# EAGLE design PololuPCB_trial3 (EAGLE 8.3.2)
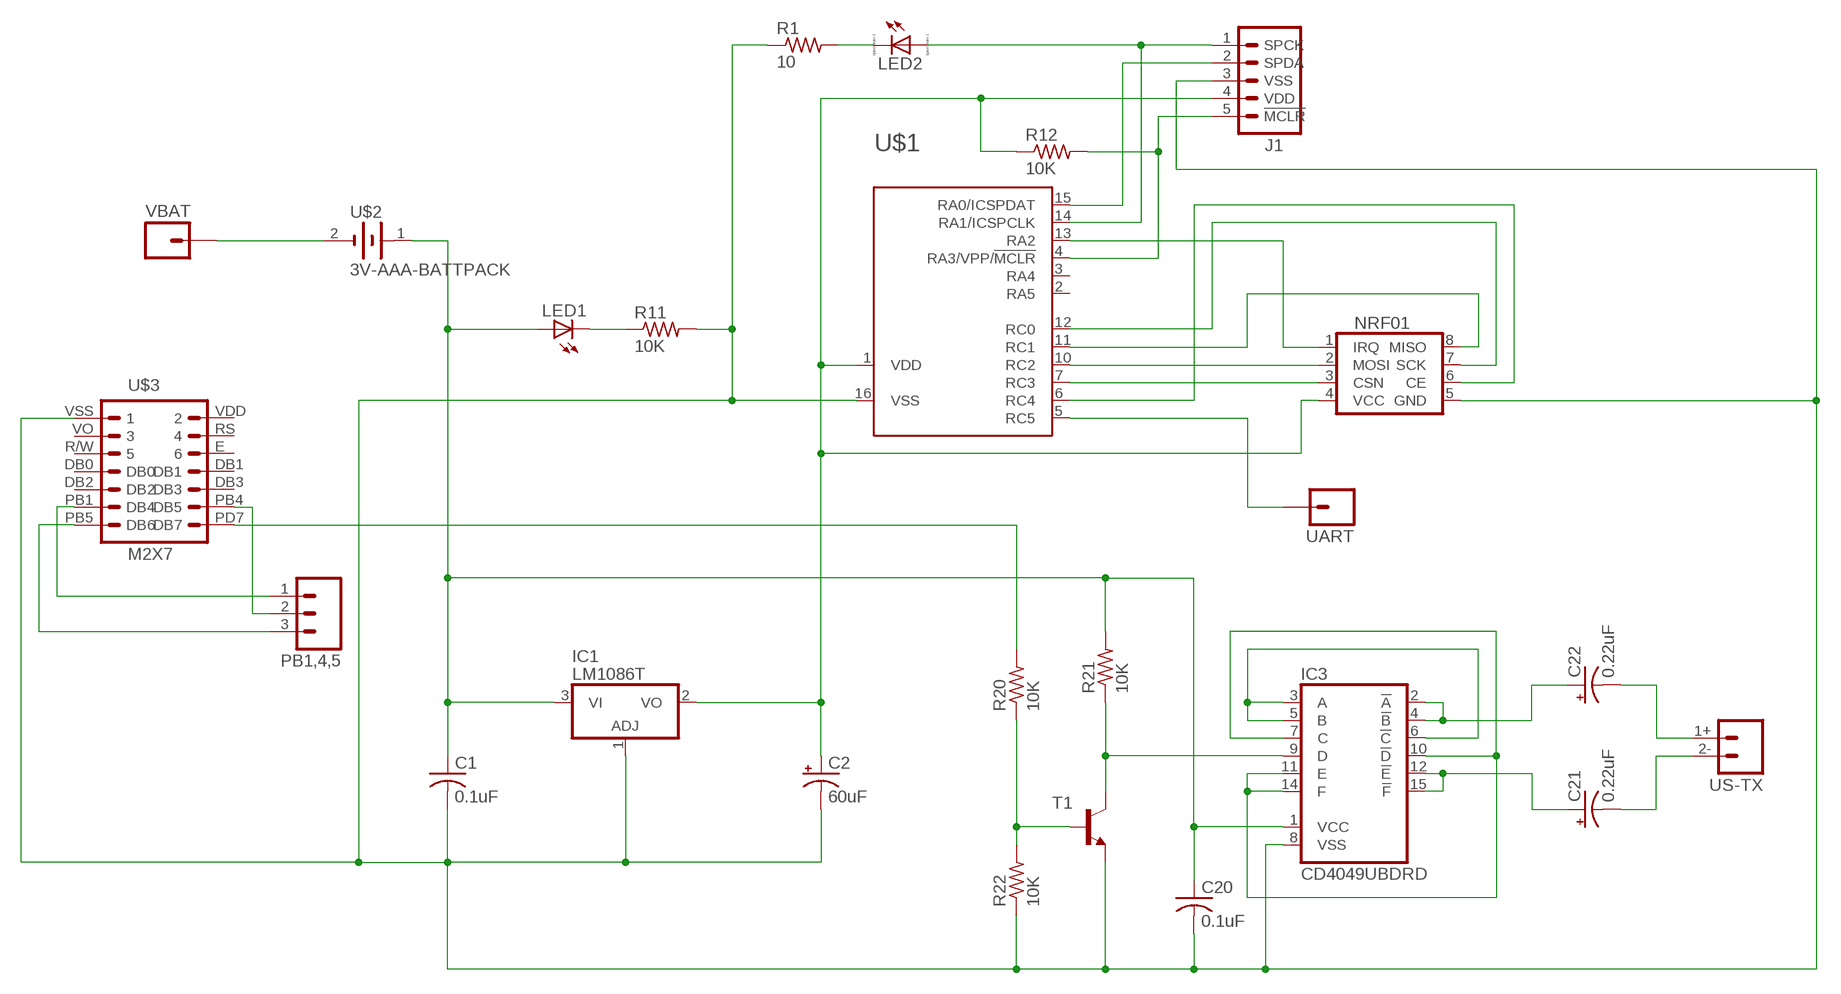
[diagram p0: schematic, sheet 1]

## Parts
C1  0.1uF  C-USC0805  [C0805]
C2  60uF  CPOL-USE2.5-5  [E2,5-5]
C20  0.1uF  C-USC0805  [C0805]
C21  0.22uF  CPOL-USE2,5-6E  [E2,5-6E]
C22  0.22uF  CPOL-USE2,5-6E  [E2,5-6E]
IC1  LM1086T  [TO220H]
IC3  CD4049UBDRD  [SO16]
J1  M05PTH  [1X05]
LED1  LED5MM  [LED5MM]
LED2  LED_E  [LED_1206]
NRF01  NRF01  [JP4Q]
PB1,4,5  M03PTH  [1X03]
R1  10  R-US_R0805  [R0805]
R11  10K  R-US_R0805  [R0805]
R12  10K  R-US_R0805  [R0805]
R20  10K  R-US_R0805  [R0805]
R21  10K  R-US_R0805  [R0805]
R22  10K  R-US_R0805  [R0805]
T1  -NPN-SOT23-EBC  [SOT23-EBC]
U$1  PIC16F1503(DIL16)  [DIL16]
U$2  3V-AAA-BATTPACK  [3V-AAA-BATTPACK]
U$3  M2X7  [2X07]
UART  M01PTH_LONGPAD  [1X01_LONGPAD]
US-TX  M02UT-1640K-TT-2-R  [ULTRASONIC-PEIZO]
VBAT  M01PTH_LONGPAD  [1X01_LONGPAD]

## Nets
N$1: IC3.9(D) R21.1 T1.C
N$2: R20.2 U$3.PD7(DB7)
N$3: IC3.7(C) IC3.10(!D) IC3.11(E) IC3.14(F)
N$4: IC3.3(A) IC3.5(B) IC3.6(!C)
N$5: C22.+ IC3.2(!A) IC3.4(!B)
N$6: C1.2 C2.- C20.2 IC1.1(ADJ) IC3.8(VSS) J1.3(VSS) NRF01.5(GND) R1.1 R11.2 R22.1 T1.E U$1.16(VSS) U$3.VSS
N$7: C21.+ IC3.12(!E) IC3.15(!F)
N$8: R20.1 R22.2 T1.B
N$9: C2.+ IC1.2(VO) J1.4(VDD) NRF01.4(VCC) R12.1 U$1.1(VDD)
N$10: LED2.C R1.2
N$11: NRF01.1(IRQ) U$1.13(RA2)
N$12: NRF01.8(MISO) U$1.11(RC1)
N$13: NRF01.3(CSN) U$1.7(RC3)
N$15: NRF01.6(CE) U$1.6(RC4)
N$16: NRF01.2(MOSI) U$1.10(RC2)
N$17: NRF01.7(SCK) U$1.12(RC0)
N$18: J1.2(SPDA) U$1.15(RA0/ICSPDAT)
N$19: J1.1(SPCK) LED2.A U$1.14(RA1/ICSPCLK)
N$20: J1.5(!MCLR) R12.2 U$1.4(RA3/VPP/!MCLR)
N$21: LED1.K(C) R11.1
N$22: C22.- US-TX.1+
N$23: C21.- US-TX.2-
N$24: C1.1 C20.1 IC1.3(VI) IC3.1(VCC) LED1.A R21.2 U$2.1(+)
N$27: U$2.2(-) VBAT.1
N$28: U$1.5(RC5) UART.1
N$31: PB1,4,5.2 U$3.PB4(DB5)
N$32: PB1,4,5.1 U$3.PB1(DB4)
N$33: PB1,4,5.3 U$3.PB5(DB6)
Unconnected: U$1.2(RA5) U$1.3(RA4) U$3.DB0 U$3.DB1 U$3.DB2 U$3.DB3 U$3.E U$3.R/W U$3.RS U$3.VDD U$3.VO

## Library data of the parts
C1 C20 = rcl:C-US: CAPACITOR, American symbol
C2 C21 C22 = rcl:CPOL-US: POLARIZED CAPACITOR, American symbol
IC1 = gac_lib:LM1086: Positive VOLTAGE REGULATOR
IC3 = gac_lib:CD4049UBDR: Stored hex INVERTER/BUFFER
J1 = gac_lib:M05: Header 5 Standard 5-pin 0.1" header. Use with straight break away headers (SKU : PRT-00116), right angle break away headers (PRT-00553), swiss pins (PRT-00743), machine pins (PRT-00117), and female headers (PRT-00115). Molex polarized connector foot print use with SKU : PRT-08230 with associated crimp pins and housings.
LED1 = led:LED: LED OSRAM: - CHIPLED LG R971, LG N971, LY N971, LG Q971, LY Q971, LO R971, LY R971 LH N974, LH R974 LS Q976, LO Q976, LY Q976 LO Q996 - Hyper CHIPLED LW Q18S LB Q993, LB Q99A, LB R99A - SideLED LS A670, LO A670, LY A670, LG A670, LP A670 LB A673, LV A673, LT A673, LW A673 LH A674 LY A675 LS A676, LA A676, LO A676, LY A676, LW A676 LS A679, LY A679, LG A679 - Hyper Micro SIDELED® LS Y876, LA Y876, LO Y876, LY Y876 LT Y87S - SmartLED LW L88C, LW L88S LB L89C, LB L89S, LG L890 LS L89K, LO L89K, LY L89K LS L896, LA L896, LO L896, LY L896 - TOPLED LS T670, LO T670, LY T670, LG T670, LP T670 LSG T670, LSP T670, LSY T670, LOP T670, LYG T670 LG T671, LOG T671, LSG T671 LB T673, LV T673, LT T673, LW T673 LH T674 LS T676, LA T676, LO T676, LY T676, LB T676, LH T676, LSB T676, LW T676 LB T67C, LV T67C, LT T67C, LS T67K, LO T67K, LY T67K, LW E67C LS E67B, LA E67B, LO E67B, LY E67B, LB E67C, LV E67C, LT E67C LW T67C LS T679, LY T679, LG T679 LS T770, LO T770, LY T770, LG T770, LP T770 LB T773, LV T773, LT T773, LW T773 LH T774 LS E675, LA E675, LY E675, LS T675 LS T776, LA T776, LO T776, LY T776, LB T776 LHGB T686 LT T68C, LB T68C - Hyper Mini TOPLED® LB M676 - Mini TOPLED Santana® LG M470 LS M47K, LO M47K, LY M47K Source: http://www.osram.convergy.de LUXEON: - LUMILED® LXK2-PW12-R00, LXK2-PW12-S00, LXK2-PW14-U00, LXK2-PW14-V00 LXK2-PM12-R00, LXK2-PM12-S00, LXK2-PM14-U00 LXK2-PE12-Q00, LXK2-PE12-R00, LXK2-PE12-S00, LXK2-PE14-T00, LXK2-PE14-U00 LXK2-PB12-K00, LXK2-PB12-L00, LXK2-PB12-M00, LXK2-PB14-N00, LXK2-PB14-P00, LXK2-PB14-Q00 LXK2-PR12-L00, LXK2-PR12-M00, LXK2-PR14-Q00, LXK2-PR14-R00 LXK2-PD12-Q00, LXK2-PD12-R00, LXK2-PD12-S00 LXK2-PH12-R00, LXK2-PH12-S00 LXK2-PL12-P00, LXK2-PL12-Q00, LXK2-PL12-R00 Source: www.luxeon.com KINGBRIGHT: KA-3528ASYC Source: www.kingbright.com
LED2 = eagle-ltspice:LED_E: LED Source: http://www.osram.convergy.de Source: www.luxeon.com Source: www.kingbright.com; SPICEMODEL: NONE; SPICEPREFIX: D; SPICETYPE: diode
NRF01 = gac_lib:NRF01: JUMPER
PB1,4,5 = SparkFun-Connectors:M03: Header 3 Standard 3-pin 0.1" header. Use with straight break away headers (SKU : PRT-00116), right angle break away headers (PRT-00553), swiss pins (PRT-00743), machine pins (PRT-00117), and female headers (PRT-00115). Molex polarized connector foot print use with SKU : PRT-08232 with associated crimp pins and housings.
R1 R11 R12 R20-R22 = resistor:R-US_: RESISTOR, American symbol
T1 = transistor:*-NPN-: NPN Transistror BF959 corrected 2008.03.06
U$1 = gac_lib:PIC16F1503(DIL16)
U$2 = gac_lib:3V-AAA-BATTPACK
U$3 = gac_lib:M2X7
UART VBAT = SparkFun-Connectors:M01: Header 1 Standard 1-pin 0.1" header. Use with straight break away headers (SKU : PRT-00116), right angle break away headers (PRT-00553), swiss pins (PRT-00743), machine pins (PRT-00117), and female headers (PRT-00115). SMTSO-256-ET is a "flush mount" nut for a 4-40 screw. The older package used to be too tight, and did not allow it to sit properly thru the drill hit. The latest (0.165DIA) fits nice and snug.
US-TX = gac_lib:M02: Standard 2-pin 0.1" header. Use with - straight break away headers ( PRT-00116) - right angle break away headers (PRT-00553) - swiss pins (PRT-00743) - machine pins (PRT-00117) - female headers (PRT-00115) Molex polarized connector foot print use with: PRT-08233 with associated crimp pins and housings. 2.54_SCREWTERM for use with PRT-10571. 3.5mm Screw Terminal footprints for PRT-08084 5mm Screw Terminal footprints for use with PRT-08432

## Board
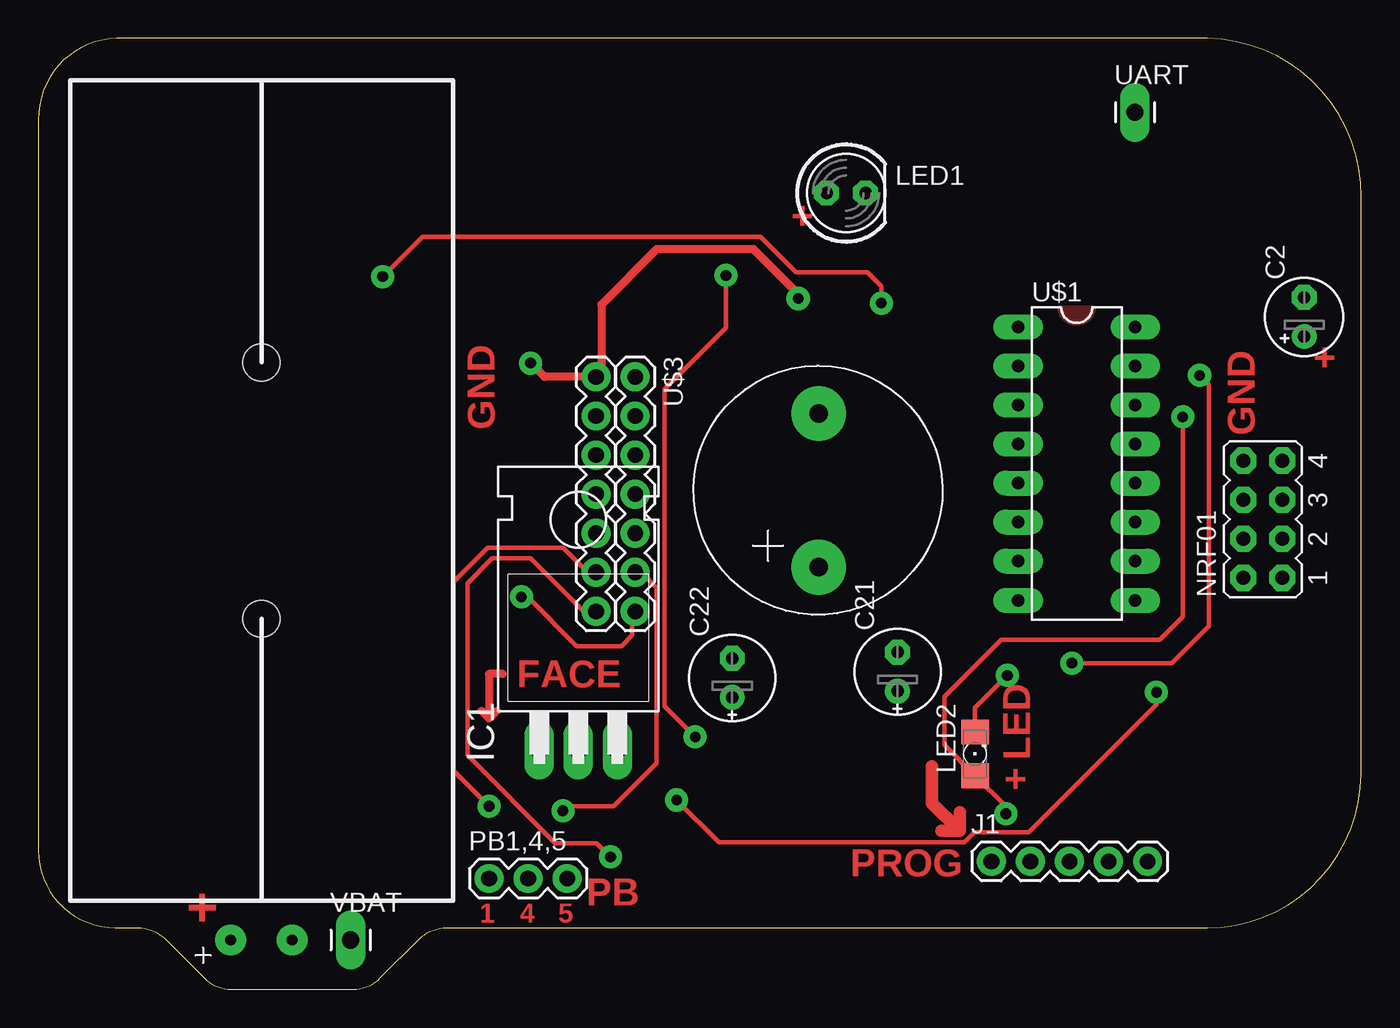
[diagram p1: board, top side]
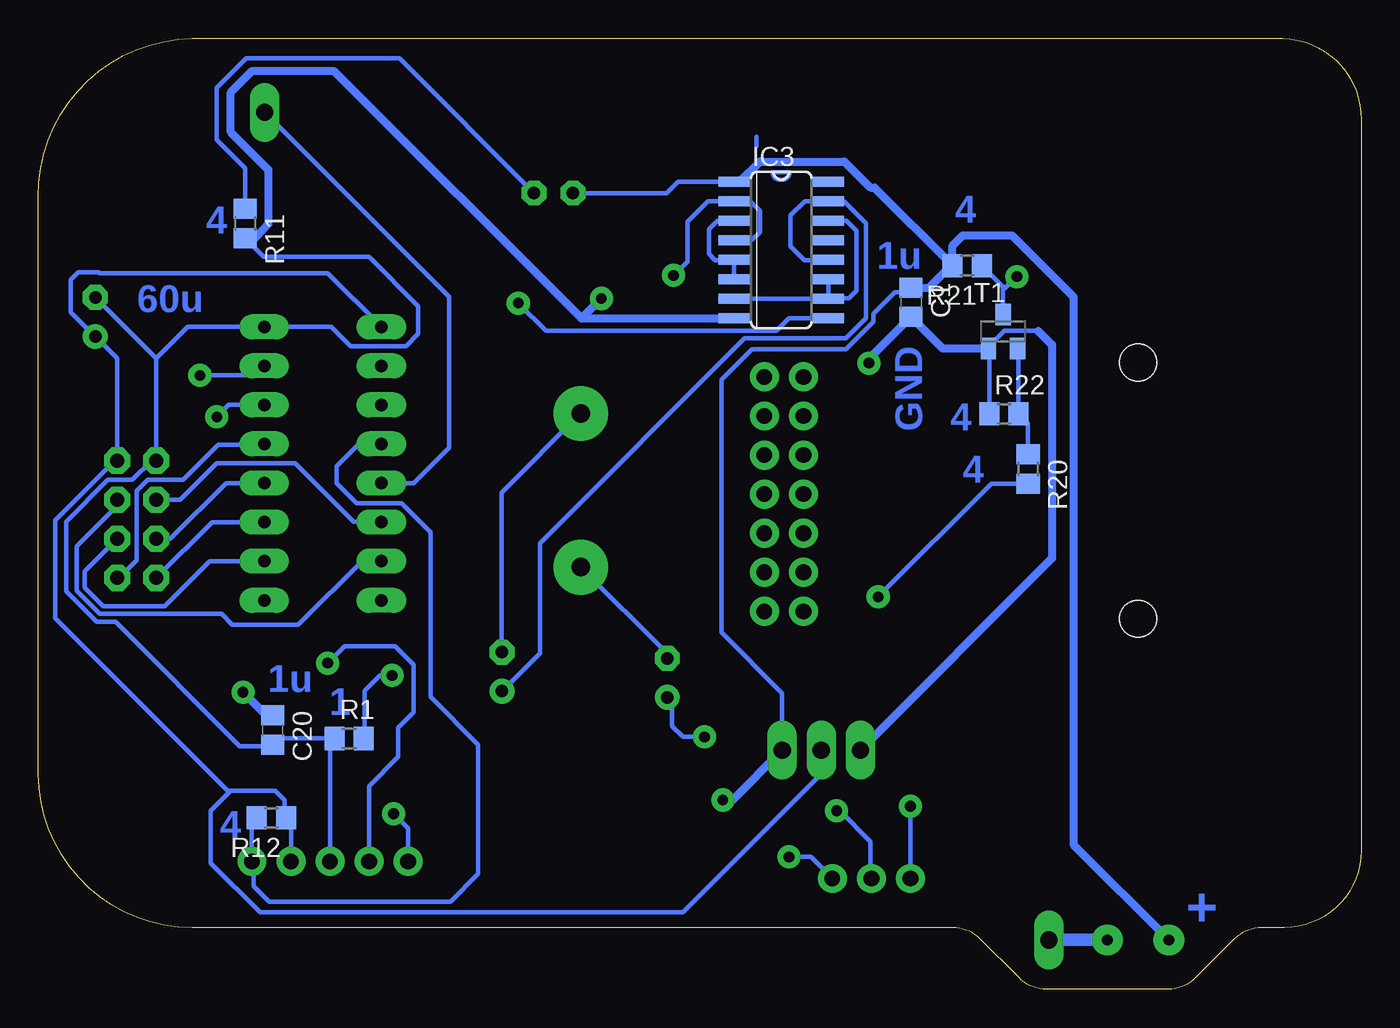
[diagram p2: board, bottom side, seen from below]

Size 86 x 61.8 mm. Coordinates in mm from the lower left corner, seen from the top.
Outline: 76,61.8 5.1,61.8 arc90 0,56.5 0,9 arc90 5,4 6.46,4 arc-45 8.23,3.27 10.77,0.73 arc45 12.54,0 20.46,0 arc45 22.23,0.73 24.77,3.27 arc-45 26.54,4 76,4 arc90 86,14 86,51.5 arc90 76,61.8
Copper layers (1*16): Top 0.06mm / dielectric 3mm / Bottom 0.06mm
Design rules "default *": minimum track width 0.3mm, minimum drill 0.35mm, track to track 0.2mm, track to pad 0.2mm, pad to pad 0.5mm, via to via 1mm, smd to smd 0mil, copper to edge 0.5mm, drill to drill 0.3mm, minimum pad ring 0.4mm, minimum via ring 0.4mm, stop-mask expansion 4mil, vias tented up to drill 0mil, thermal gap 10mil

### Footprints (pad centres in the part's own frame; a part is rotated, then mirrored left to right if it is on the bottom)
C0805 = smd 1.3 x 1.5: 1 -0.95,0; 2 0.95,0
E2,5-5 = drill 0.813 pad 1.6: + -1.27,0 | drill 0.813 pad 1.6 octagon: - 1.27,0
E2,5-6E = drill 0.813 pad 1.575: + -1.27,0 | drill 0.813 pad 1.575 octagon: - 1.27,0
TO220H = drill 1.118 long: 1 -2.54,-10.16; 2 0,-10.16; 3 2.54,-10.16
SO16 = smd 0.66 x 2.032: 1 -4.445,-3.073; 2 -3.175,-3.073; 3 -1.905,-3.073; 4 -0.635,-3.073; 5 0.635,-3.073; 6 1.905,-3.073; 7 3.175,-3.073; 8 4.445,-3.073; 9 4.445,3.073; 10 3.175,3.073; 11 1.905,3.073; 12 0.635,3.073; 13 -0.635,3.073; 14 -1.905,3.073; 15 -3.175,3.073; 16 -4.445,3.073
1X05 = drill 1.016 pad 1.88: 1 0,0; 2 2.54,0; 3 5.08,0; 4 7.62,0; 5 10.16,0
LED5MM = drill 0.813 octagon: A -1.27,0; K 1.27,0
LED_1206 = smd 1.6 x 1.803: A -1.422,0; C 1.422,0
JP4Q = drill 0.914 octagon: 1 -3.81,-1.27; 2 -1.27,-1.27; 3 1.27,-1.27; 4 3.81,-1.27; 5 3.81,1.27; 6 1.27,1.27; 7 -1.27,1.27; 8 -3.81,1.27
1X03 = drill 1.016 pad 1.88: 1 0,0; 2 2.54,0; 3 5.08,0
R0805 = smd 1.3 x 1.5: 1 -0.95,0; 2 0.95,0
SOT23-EBC = smd 1 x 1.4: B 0.95,-1.1; C 0,1.1; E -0.95,-1.1
DIL16 = drill 0.813 long: 1 -8.89,-3.81; 2 -6.35,-3.81; 3 -3.81,-3.81; 4 -1.27,-3.81; 5 1.27,-3.81; 6 3.81,-3.81; 7 6.35,-3.81; 8 8.89,-3.81; 9 8.89,3.81; 10 6.35,3.81; 11 3.81,3.81; 12 1.27,3.81; 13 -1.27,3.81; 14 -3.81,3.81; 15 -6.35,3.81; 16 -8.89,3.81
3V-AAA-BATTPACK = drill 0.7 pad 2: 1 0,-2; 2 0,2 | hole 2.388: -37.541,0; -20.879,0
2X07 = drill 1.016 pad 1.88: DB0 7.62,-2.54; DB1 7.62,0; DB2 10.16,-2.54; DB3 10.16,0; E 5.08,0; PB1 12.7,-2.54; PB4 12.7,0; PB5 15.24,-2.54; PD7 15.24,0; R/W 5.08,-2.54; RS 2.54,0; VDD 0,0; VO 2.54,-2.54; VSS 0,-2.54
1X01_LONGPAD = drill 1.118 pad 1.88 long: 1 0,0
ULTRASONIC-PEIZO = drill 1.2 pad 3.556: 1+ -5,0; 2- 5,0

### Placement (x,y rotation side)
C1  29.26,44.66 270 bottom
C2  82.3,43.7 90 top
C20  70.77,16.85 270 bottom
C21  55.86,20.64 90 top
C22  45.11,20.24 90 top
IC1  35.1,25.7 0 top
IC3  37.7,48.05 270 bottom
J1  61.96,8.31 0 top
LED1  52.51,51.75 0 top
LED2  60.9,15.3 90 top
NRF01  79.61,30.55 90 top
PB1,4,5  29.3,7.2 0 top
R1  65.8,16.3 0 bottom
R11  72.56,49.77 270 bottom
R12  70.85,11.14 180 bottom
R20  21.65,33.82 270 bottom
R21  25.61,47.03 180 bottom
R22  23.22,37.4 0 bottom
T1  23.28,42.76 0 bottom
U$1  67.51,34.17 270 top
U$2  14.5,3.2 270 top
U$3  38.8,39.8 270 top
UART  71.3,57 0 top
US-TX  50.74,32.43 90 top
VBAT  20.3,3.2 0 top

### Tracks (layer width: path | path; a pad name or v marks a point on that pad's centre or on a via)
N$1  (via drill 0.7 pad 1.1)
  Top 0.305: v54.8,44.6 54.8,45.7 53.9,46.6 49.26,46.6 46.95,48.91 24.96,48.91 v22.38,46.32
  Bottom 0.305: 23.28,45.6 T1.C | 23.28,45.6 23.28,45.65 R21.1 | IC3.9 37.2,43.6 37.99,42.8 53.01,42.8 v54.8,44.6 | v22.38,46.32 23.2,45.52 23.28,45.6
N$2  (via drill 0.7 pad 1.1)
  Top 0.305: v31.4,25.5 31.8,25.5 35,22.3 37.9,22.3 38.6,23 38.6,24.36 U$3.PD7
  Bottom 0.305: v31.4,25.5 24.03,32.87 R20.2
N$3
  Bottom 0.305: IC3.14 33.45,49.95 32.8,49.3 32.8,45.4 33.3,44.9 34.6,44.9 | 34.6,44.9 IC3.10 IC3.7 | IC3.11 34.63,44.92 34.6,44.9
N$4
  Bottom 0.305: IC3.3 41.84,49.95 42.4,49.4 42.4,47.8 42,47.4 40.79,47.4 IC3.5 IC3.6
N$5  (via drill 0.7 pad 1.1)
  Top 0.305: v44.7,46.4 44.7,43 40.7,39 40.7,18.4 v42.7,16.4
  Bottom 0.305: IC3.4 40.76,48.7 39.6,48.7 39.1,49.2 39.1,50.6 39.73,51.23 IC3.2 42.48,51.23 43.8,49.9 43.8,47.3 v44.7,46.4 | v42.7,16.4 44.1,16.4 44.8,17.1 44.8,18.66 C22.+
N$6  (via drill 0.7 pad 1.1)
  Top 0.508: v32,40.7 32.9,39.8 U$3.VSS 36.6,40.14 36.6,44.5 40.2,48.1 46.5,48.1 49.4,45.2 v49.4,44.9
  Bottom 0.305: 78.34,41.01 NRF01.5 78.64,34.36 79.9,33.1 81.5,33.1 84.2,30.4 84.2,29.21 84.2,25.88 82.22,23.89 80.99,23.89 72.9,15.8 70.87,15.8 C20.2 70.37,16.3 R1.1 67.04,16.01 J1.3 | 78.34,41.01 C2.- | 78.34,41.01 76.29,43.06 U$1.16 66.96,43.06 65.7,41.8 62.1,41.8 61.3,42.6 61.3,44.4 64.5,47.6 71.34,47.6 72.22,48.48 R11.2 | 40.88,43.6 IC3.8 | R22.1 24.17,41.6 T1.E 24.23,41.77 23.2,42.8 21,42.8
  Bottom 0.508: 50.7,43.6 66.8,59.7 72.09,59.7 73.5,58.29 73.5,55.71 71.06,53.27 71.06,49.74 72.22,48.48 | 50.7,43.6 40.88,43.6 | T1.E 27.21,41.66 C1.2 32,40.97 v32,40.7 | 21,42.8 20.1,41.9 20.1,28 IC1.1 | 50.7,43.6 v49.4,44.9
N$7
  Bottom 0.305: IC3.12 34.64,47.4 36.2,47.4 37.1,48.3 37.1,50.3 36.17,51.23 IC3.15 33.62,51.23 32.2,49.8 32.2,43.6 33.5,42.3 40.1,42.3 53.4,29 53.4,21.83 C21.+
N$8
  Bottom 0.305: T1.B 22.27,41.6 R22.2 21.65,36.78 R20.1
N$9
  Bottom 0.305: 80.88,34.5 80.88,41.01 C2.+ 82.33,42.43 83.9,44 83.9,46.1 83.4,46.6 82.09,46.6 82.05,46.55 67.19,46.55 U$1.1 | 80.88,34.5 NRF01.4 | J1.4 69.58,10.82 R12.1 70,11.24 70,12.3 70.6,12.9 73.5,12.9 | 73.5,12.9 74.8,11.6 74.8,8.2 71.6,5 44.1,5 35.1,14 IC1.2 | 73.5,12.9 73.7,12.9 84.9,24.1 84.9,30.48 80.88,34.5
N$10  (via drill 0.7 pad 1.1)
  Top 0.305: LED2.C 60.9,18.3 v63,20.4
  Bottom 0.305: v63,20.4 63.8,20.4 64.8,19.4 64.8,16.35 R1.2
N$11
  Bottom 0.305: NRF01.1 80.76,26.74 79.7,27.8 79.6,27.9 79.6,32.4 78.9,33.1 76.6,33.1 74.3,35.4 71.36,35.4 U$1.13
N$12
  Bottom 0.305: U$1.11 74.72,30.36 NRF01.8
N$13
  Bottom 0.305: U$1.7 63.78,27.9 64.9,27.9 69.1,23.7 73.4,23.7 74.09,24.39 82.01,24.39 83.5,25.89 83.5,28.8 80.88,31.43 NRF01.3
N$14
  pour Top: 66.4,44.3 68.6,44.3 arc-90 67.6,43.3 67.5,43.3 67.4,43.3 arc-90
N$15
  Bottom 0.305: NRF01.6 76.78,31.82 74.4,34.2 69.3,34.2 65.5,30.4 63.74,30.4 U$1.6
N$16
  Bottom 0.305: U$1.10 74.88,27.82 77.8,24.9 81.8,24.9 83,26.1 83,27.16 NRF01.2
N$17
  Bottom 0.305: NRF01.7 77.42,29.28 73.8,32.9 U$1.12
N$18  (via drill 0.7 pad 1.1)
  Top 0.305: v67.2,21.2 73.7,21.2 76.1,23.6 76.1,39.3 v75.5,39.9
  Bottom 0.305: J1.2 64.5,13.2 62.6,15.1 62.6,17 61.6,18 61.6,21.1 62.8,22.3 66.1,22.3 v67.2,21.2 | v75.5,39.9 71.94,39.9 U$1.15
N$19  (via drill 0.7 pad 1.1)
  Top 0.305: v62.9,11.4 62.9,11.88 LED2.A 58.9,15.88 58.9,19 62.6,22.7 72.9,22.7 74.4,24.2 v74.4,37.2
  Bottom 0.305: J1.1 61.96,10.46 v62.9,11.4 | U$1.14 73.62,37.98 v74.4,37.2
N$20
  Bottom 0.305: U$1.4 65.16,35.44 66.6,34 66.6,32.9 65.3,31.6 62.4,31.6 60.5,29.7 60.5,19 57.4,15.9 57.4,7.5 59.2,5.7 71,5.7 72,6.7 72,8.19 J1.5 72.12,10.82 R12.2
N$21
  Bottom 0.305: R11.1 72.56,53.36 74.4,55.2 74.4,58.6 72.5,60.5 62.53,60.5 LED1.K
N$22
  Bottom 0.305: C22.- 45.11,21.8 US-TX.1+
N$23
  Bottom 0.305: C21.- 55.9,22 55.9,32.27 US-TX.2-
N$24  (via drill 0.7 pad 1.1)
  Top 0.305: v72.7,19.3 72.7,18.5 64.4,10.2 60.87,10.2 60.21,9.54 44.26,9.54 v41.5,12.3
  Bottom 0.305: LED1.A 45.15,51.75 44.4,52.5 IC3.1 40.41,52.49 | C20.1 71.2,17.8 | 26.61,47.09 R21.2 | C1.1 29.2,45.61 29.51,45.3 30.3,45.3 31.7,43.91 31.7,43.39 33.49,41.6 39.6,41.6 41.6,39.6 41.6,23.2 37.64,19.24 IC1.3
  Bottom 0.508: 71.2,17.8 v72.7,19.3 | v41.5,12.3 40.88,12.3 IC1.3 | 40.41,52.49 39.1,53.8 33.6,53.8 31.9,52.1 31.63,52.1 26.61,47.09 28.09,45.61 29.2,45.61 | R21.2 26.56,48.34 25.9,49 22.7,49 18.7,45 18.7,9.4 U$2.1
N$25
  Top 0.813: 58.1,14.5 58.1,12.1 59.9,10.3 58.7,10.3
N$26
  Top 0.813: 59.9,10.4 59.9,11.5
N$27
  Bottom 0.813: VBAT.1 U$2.2
N$28
  Bottom 0.305: U$1.5 61.6,32.9 59.3,35.2 59.3,45 UART.1
N$29
  Top 0.508: 30.2,20.5 29.3,20.5 29.3,17.6 | 29.3,17.6 29.8,18.1 | 29.3,17.6 28.8,18.1
N$31  (via drill 0.7 pad 1.1)
  Top 0.305: U$3.PB4 39.2,27.1 40.2,26.11 40.2,14.7 37.4,11.9 34.4,11.9 v34.1,11.6
  Bottom 0.305: v34.1,11.6 33.9,11.6 31.9,9.6 31.9,7.26 PB1,4,5.2
N$32  (via drill 0.7 pad 1.1)
  Top 0.305: U$3.PB1 35.7,27.1 34.1,28.7 29.2,28.7 27,26.5 27,14.2 v29.3,11.9
  Bottom 0.305: v29.3,11.9 PB1,4,5.1
N$33  (via drill 0.7 pad 1.1)
  Top 0.305: U$3.PB5 35.44,24.56 32,28 29.5,28 27.9,26.4 27.9,15.2 33.6,9.5 36.3,9.5 v37.2,8.6
  Bottom 0.305: v37.2,8.6 35.78,8.6 PB1,4,5.3
N$35
  Bottom 0.305: 39.3,54.8 39.3,55.4
N$36
  Bottom 0.305: 38.26,53.12 arc-90 37.76,52.62 37.66,52.62 arc-90 37.16,53.12 38.26,53.12

### Text on the board
Top: + | GND | + | GND | FACE | LED | + | PROG | PB | 1 | 4 | 5 | +
Bottom: 4 | 4 | 1u | 60u | GND | 4 | 4 | 1u | 1 | 4 | +